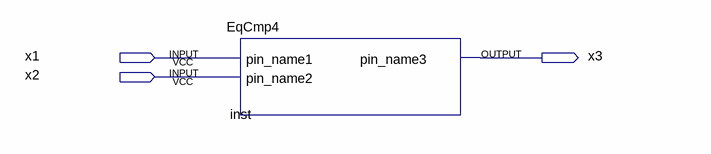
[diagram p0: schematic sheet]
// Quartus schematic EqCmpDemo.bdf as structural Verilog: 1 symbols, 3 pins
module EqCmpDemo (
  input  x1,
  input  x2,
  output x3
);

  EqCmp4 inst (.pin_name1(x1), .pin_name2(x2), .pin_name3(x3));
endmodule
